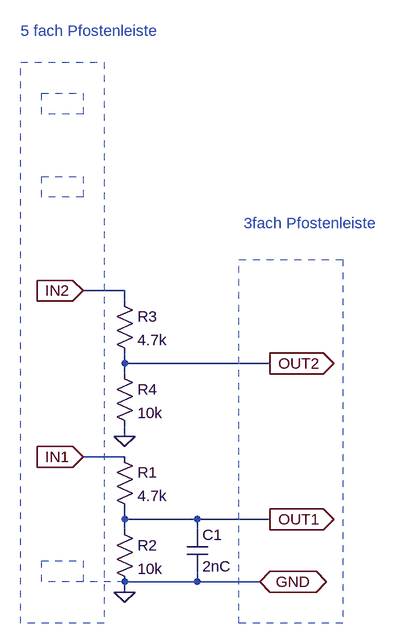
[diagram p0: schematic Levelshifter5_3.asc]
Levelshifter5_3.asc, the LTspice schematic file:
Version 4
SHEET 1 880 680
WIRE 240 80 176 80
WIRE 240 96 240 80
WIRE 240 192 240 176
WIRE 464 192 240 192
WIRE 240 208 240 192
WIRE 240 304 240 288
WIRE 240 336 176 336
WIRE 240 432 240 416
WIRE 352 432 240 432
WIRE 464 432 352 432
WIRE 240 448 240 432
WIRE 352 448 352 432
WIRE 352 528 352 512
WIRE 352 528 240 528
WIRE 448 528 352 528
WIRE 240 544 240 528
FLAG 240 544 0
FLAG 240 304 0
FLAG 176 336 IN1
IOPIN 176 336 In
FLAG 176 80 IN2
IOPIN 176 80 In
FLAG 464 432 OUT1
IOPIN 464 432 Out
FLAG 464 192 OUT2
IOPIN 464 192 Out
FLAG 448 528 GND
IOPIN 448 528 BiDir
SYMBOL res 224 320 R0
SYMATTR InstName R1
SYMATTR Value 4.7k
SYMBOL res 224 432 R0
SYMATTR InstName R2
SYMATTR Value 10k
SYMBOL res 224 80 R0
SYMATTR InstName R3
SYMATTR Value 4.7k
SYMBOL res 224 192 R0
SYMATTR InstName R4
SYMATTR Value 10k
SYMBOL cap 336 448 R0
SYMATTR InstName C1
SYMATTR Value 2nC
TEXT 80 -320 Left 2 ;5 fach Pfostenleiste
TEXT 424 -24 Left 2 ;3fach Pfostenleiste
LINE Normal 240 528 176 528 2
RECTANGLE Normal 176 528 112 496 2
RECTANGLE Normal 576 592 416 32 2
RECTANGLE Normal 208 592 80 -272 2
RECTANGLE Normal 176 -192 112 -224 2
RECTANGLE Normal 176 -64 112 -96 2

The netlist it stands for:
* Levelshifter5_3.asc
R1 IN1 OUT1 4.7k
R2 OUT1 0 10k
R3 IN2 OUT2 4.7k
R4 OUT2 0 10k
C1 OUT1 0 2nC
* 5 fach Pfostenleiste
* 3fach Pfostenleiste
.backanno
.end